# Altium project Carte_design.PrjPcb (part 1 of 2)
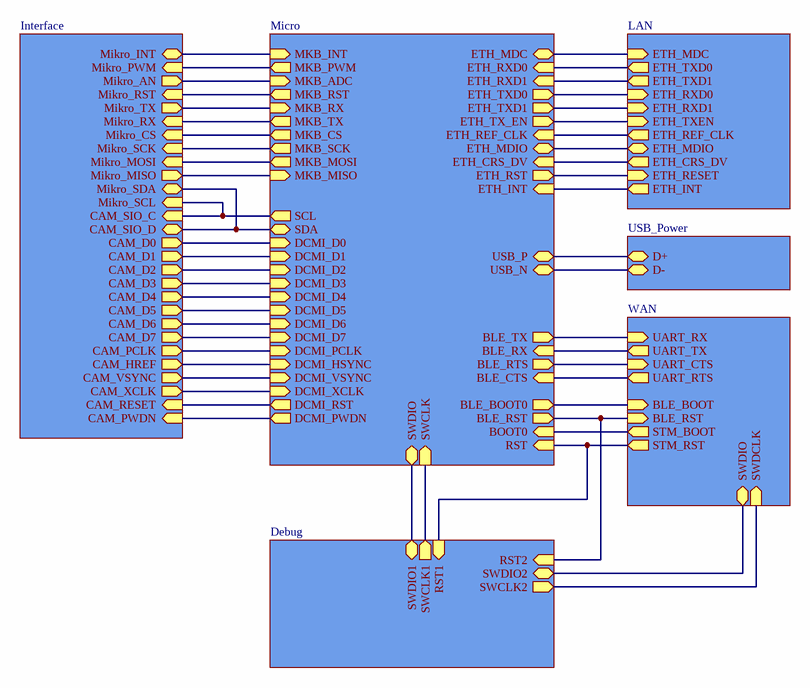
[diagram p0: Carte_design_SCH.SchDoc]
7 sheets, 181 parts. Net scope: hierarchical (ports join the sheet entries above them; power ports are global).
Board file: PCB_carte_design.PcbDoc
Sheets:
  Carte_design_SCH.SchDoc
    Interface = Interface.SchDoc
    USB_Power = USB_Power.SchDoc
    LAN = LAN.SchDoc
    WAN = WAN.SchDoc
    Micro = Micro.SchDoc
    Debug = Debug.SchDoc

## Sheet Carte_design_SCH.SchDoc: STM32_DEVBOARD
size A4; Revision: 1

### Sub-sheets
Debug = Debug.SchDoc: SWDIO2 (bidir), SWDIO1 (bidir), SWCLK1 (out), SWCLK2 (out), RST2 (in), RST1 (in)
Interface = Interface.SchDoc: Mikro_INT (bidir), Mikro_TX (out), Mikro_PWM (in), Mikro_AN (out), Mikro_SDA (bidir), Mikro_MISO (out), Mikro_RST (in), Mikro_SCL (in), Mikro_SCK (in), Mikro_MOSI (in), Mikro_CS (in), Mikro_RX (in), CAM_D6 (out), CAM_PCLK (out), CAM_D3 (out), CAM_RESET (in), CAM_D4 (out), CAM_SIO_C (in), CAM_D7 (out), CAM_D1 (out), CAM_D0 (out), CAM_SIO_D (bidir), CAM_HREF (out), CAM_D5 (out), CAM_VSYNC (out), CAM_D2 (out), CAM_PWDN (in), CAM_XCLK (out)
LAN = LAN.SchDoc: ETH_INT (out), ETH_MDC (in), ETH_REF_CLK (out), ETH_TXEN (in), ETH_MDIO (bidir), ETH_CRS_DV (out), ETH_RESET (in), ETH_TXD0 (out), ETH_TXD1 (out), ETH_RXD0 (in), ETH_RXD1 (in)
Micro = Micro.SchDoc: USB_N (bidir), DCMI_VSYNC (in), DCMI_D1 (in), DCMI_XCLK (in), SDA (bidir), BLE_RX (in), SWDIO (bidir), MKB_MOSI (out), MKB_RX (in), MKB_RST (out), ETH_MDC (bidir), ETH_RXD0 (in), DCMI_PWDN (out), ETH_MDIO (bidir), DCMI_D3 (in), DCMI_HSYNC (in), USB_P (bidir), DCMI_D2 (in), DCMI_D4 (in), BLE_RST (out), ETH_TXD0 (out), ETH_TXD1 (out), MKB_PWM (out), BLE_CTS (in), MKB_CS (out), ETH_TX_EN (out), DCMI_D6 (in), SWCLK (in), DCMI_D5 (in), DCMI_PCLK (in), SCL (out), MKB_SCK (out), ETH_RXD1 (in), DCMI_D0 (in), DCMI_D7 (in), DCMI_RST (out), MKB_MISO (in), BLE_BOOT0 (out), MKB_INT (in), BLE_TX (out), ETH_RST (out), MKB_TX (out), RST (in), MKB_ADC (in), BLE_RTS (out), BOOT0 (in), ETH_CRS_DV (in), ETH_REF_CLK (in), ETH_INT (in)
USB_Power = USB_Power.SchDoc: D+ (bidir), D- (bidir)
WAN = WAN.SchDoc: UART_RX (in), STM_RST (out), UART_TX (out), UART_CTS (in), BLE_BOOT (in), SWDIO (bidir), BLE_RST (in), UART_RTS (out), SWDCLK (in), STM_BOOT (out)

### Nets
CRS: sheet LAN/ETH_CRS_DV, sheet Micro/ETH_CRS_DV
INT: sheet LAN/ETH_INT, sheet Micro/ETH_INT
MDC: sheet LAN/ETH_MDC, sheet Micro/ETH_MDC
MDIO: sheet LAN/ETH_MDIO, sheet Micro/ETH_MDIO
REF_CLK: sheet LAN/ETH_REF_CLK, sheet Micro/ETH_REF_CLK
RST1: sheet WAN/STM_RST, sheet Micro/RST, sheet Debug/RST1
RST2: sheet WAN/BLE_RST, sheet Micro/BLE_RST, sheet Debug/RST2
RXD0: sheet LAN/ETH_RXD0, sheet Micro/ETH_TXD0
RXD1: sheet LAN/ETH_RXD1, sheet Micro/ETH_TXD1
SWCLK1: sheet Micro/SWCLK, sheet Debug/SWCLK1
SWCLK2: sheet WAN/SWDCLK, sheet Debug/SWCLK2
SWDIO1: sheet Micro/SWDIO, sheet Debug/SWDIO1
SWDIO2: sheet WAN/SWDIO, sheet Debug/SWDIO2
TXD0: sheet LAN/ETH_TXD0, sheet Micro/ETH_RXD0
TXD1: sheet LAN/ETH_TXD1, sheet Micro/ETH_RXD1
TXEN: sheet LAN/ETH_TXEN, sheet Micro/ETH_TX_EN
USB_COM_N: sheet USB_Power/D-, sheet Micro/USB_N
USB_COM_P: sheet USB_Power/D+, sheet Micro/USB_P
NetD3_2: sheet LAN/ETH_RESET, sheet Micro/ETH_RST
NetJ2_3: sheet Interface/Mikro_SCL, sheet Interface/CAM_SIO_C, sheet Micro/SCL
NetJ2_4: sheet Interface/Mikro_SDA, sheet Interface/CAM_SIO_D, sheet Micro/SDA
NetJ2_8: sheet Interface/CAM_XCLK, sheet Micro/DCMI_XCLK
NetJ2_17: sheet Interface/CAM_RESET, sheet Micro/DCMI_RST
NetJ2_18: sheet Interface/CAM_PWDN, sheet Micro/DCMI_PWDN
NetMIKROBUS_1_1: sheet Interface/Mikro_AN, sheet Micro/MKB_ADC
NetMIKROBUS_1_2: sheet Interface/Mikro_RST, sheet Micro/MKB_RST
NetMIKROBUS_1_3: sheet Interface/Mikro_CS, sheet Micro/MKB_CS
NetMIKROBUS_1_4: sheet Interface/Mikro_SCK, sheet Micro/MKB_SCK
NetMIKROBUS_1_5: sheet Interface/Mikro_MISO, sheet Micro/MKB_MISO
NetMIKROBUS_1_6: sheet Interface/Mikro_MOSI, sheet Micro/MKB_MOSI
NetMIKROBUS_1_13: sheet Interface/Mikro_TX, sheet Micro/MKB_RX
NetMIKROBUS_1_14: sheet Interface/Mikro_RX, sheet Micro/MKB_TX
NetMIKROBUS_1_15: sheet Interface/Mikro_INT, sheet Micro/MKB_INT
NetMIKROBUS_1_16: sheet Interface/Mikro_PWM, sheet Micro/MKB_PWM
NetR19_1: sheet Interface/CAM_VSYNC, sheet Micro/DCMI_VSYNC
NetR20_2: sheet Interface/CAM_HREF, sheet Micro/DCMI_HSYNC
NetR21_1: sheet Interface/CAM_PCLK, sheet Micro/DCMI_PCLK
NetR22_1: sheet Interface/CAM_D7, sheet Micro/DCMI_D7
NetR23_2: sheet Interface/CAM_D6, sheet Micro/DCMI_D6
NetR24_1: sheet Interface/CAM_D5, sheet Micro/DCMI_D5
NetR25_2: sheet Interface/CAM_D4, sheet Micro/DCMI_D4
NetR26_1: sheet Interface/CAM_D3, sheet Micro/DCMI_D3
NetR27_2: sheet Interface/CAM_D2, sheet Micro/DCMI_D2
NetR28_1: sheet Interface/CAM_D1, sheet Micro/DCMI_D1
NetR29_2: sheet Interface/CAM_D0, sheet Micro/DCMI_D0
NetR61_1: sheet WAN/UART_RX, sheet Micro/BLE_TX
NetR62_1: sheet WAN/UART_TX, sheet Micro/BLE_RX
NetR63_2: sheet WAN/BLE_BOOT, sheet Micro/BLE_BOOT0
NetR65_2: sheet WAN/STM_BOOT, sheet Micro/BOOT0
NetU10_11: sheet WAN/UART_RTS, sheet Micro/BLE_CTS
NetU10_12: sheet WAN/UART_CTS, sheet Micro/BLE_RTS

## Sheet Interface.SchDoc
size A4
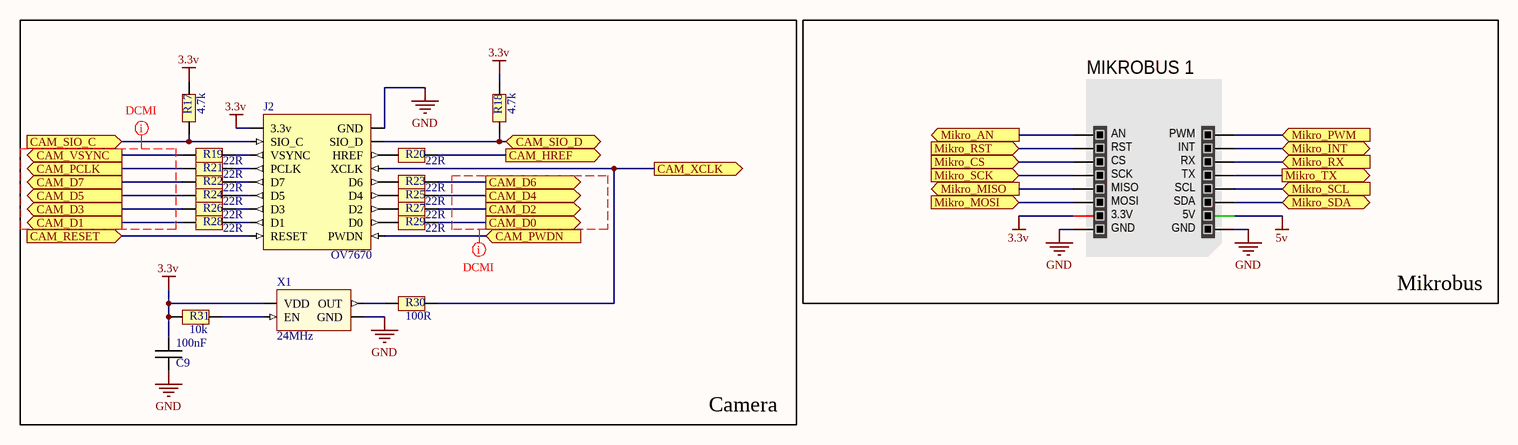
[diagram p1: Interface.SchDoc]

### Parts
C9  100nF  [0603]
J2  OV7670  [Header_2.54_2rang]
MIKROBUS_1  MIKROBUS HOST CONN.  [MIKROBUS HOST CONN.]  (value not drawn)
R17  4.7k  [0603]
R18  4.7k  [0603]
R19  22R  [0603]
R20  22R  [0603]
R21  22R  [0603]
R22  22R  [0603]
R23  22R  [0603]
R24  22R  [0603]
R25  22R  [0603]
R26  22R  [0603]
R27  22R  [0603]
R28  22R  [0603]
R29  22R  [0603]
R30  100R  [0603]
R31  10k  [0603]
X1  24MHz  [Oscillateur]

### Blocks framed on the sheet
Camera: C9 J2 R17-R31 X1
Mikrobus: MIKROBUS_1

### Ports
CAM_D0 (out), CAM_D1 (out), CAM_D2 (out), CAM_D3 (out), CAM_D4 (out), CAM_D5 (out), CAM_D6 (out), CAM_D7 (out), CAM_HREF (out), CAM_PCLK (out), CAM_PWDN (in), CAM_RESET (in), CAM_SIO_C (in), CAM_SIO_D (bidir), CAM_VSYNC (out), CAM_XCLK (out), Mikro_AN (out), Mikro_CS (in), Mikro_INT (bidir), Mikro_MISO (out), Mikro_MOSI (in), Mikro_PWM (in), Mikro_RST (in), Mikro_RX (in), Mikro_SCK (in), Mikro_SCL (in), Mikro_SDA (bidir), Mikro_TX (out)

### Nets
3.3v: C9.2 J2.1(3.3v) MIKROBUS_1.7(3.3V) R17.2 R18.2 R31.1 X1.4(VDD)
5v: MIKROBUS_1.10(5V)
GND: C9.1 J2.2(GND) MIKROBUS_1.8(GND) MIKROBUS_1.9(GND) X1.2(GND)
NetJ2_3: J2.3(SIO_C) MIKROBUS_1.12(SCL) R17.1 ; port Mikro_SCL, port CAM_SIO_C
NetJ2_4: J2.4(SIO_D) MIKROBUS_1.11(SDA) R18.1 ; port Mikro_SDA, port CAM_SIO_D
NetJ2_5: J2.5(VSYNC) R19.2
NetJ2_6: J2.6(HREF) R20.1
NetJ2_7: J2.7(PCLK) R21.2
NetJ2_8: J2.8(XCLK) R30.2 ; port CAM_XCLK
NetJ2_9: J2.9(D7) R22.2
NetJ2_10: J2.10(D6) R23.1
NetJ2_11: J2.11(D5) R24.2
NetJ2_12: J2.12(D4) R25.1
NetJ2_13: J2.13(D3) R26.2
NetJ2_14: J2.14(D2) R27.1
NetJ2_15: J2.15(D1) R28.2
NetJ2_16: J2.16(D0) R29.1
NetJ2_17: J2.17(RESET) ; port CAM_RESET
NetJ2_18: J2.18(PWDN) ; port CAM_PWDN
NetMIKROBUS_1_1: MIKROBUS_1.1(AN) ; port Mikro_AN
NetMIKROBUS_1_2: MIKROBUS_1.2(RST) ; port Mikro_RST
NetMIKROBUS_1_3: MIKROBUS_1.3(CS) ; port Mikro_CS
NetMIKROBUS_1_4: MIKROBUS_1.4(SCK) ; port Mikro_SCK
NetMIKROBUS_1_5: MIKROBUS_1.5(MISO) ; port Mikro_MISO
NetMIKROBUS_1_6: MIKROBUS_1.6(MOSI) ; port Mikro_MOSI
NetMIKROBUS_1_13: MIKROBUS_1.13(TX) ; port Mikro_TX
NetMIKROBUS_1_14: MIKROBUS_1.14(RX) ; port Mikro_RX
NetMIKROBUS_1_15: MIKROBUS_1.15(INT) ; port Mikro_INT
NetMIKROBUS_1_16: MIKROBUS_1.16(PWM) ; port Mikro_PWM
NetR19_1: R19.1 ; port CAM_VSYNC
NetR20_2: R20.2 ; port CAM_HREF
NetR21_1: R21.1 ; port CAM_PCLK
NetR22_1: R22.1 ; port CAM_D7
NetR23_2: R23.2 ; port CAM_D6
NetR24_1: R24.1 ; port CAM_D5
NetR25_2: R25.2 ; port CAM_D4
NetR26_1: R26.1 ; port CAM_D3
NetR27_2: R27.2 ; port CAM_D2
NetR28_1: R28.1 ; port CAM_D1
NetR29_2: R29.2 ; port CAM_D0
NetR30_1: R30.1 X1.3(OUT)
NetR31_2: R31.2 X1.1(EN)

### Layout directives
rule Matched Net Lengths [Tolerance = 2mm]; net class DCMI: (no net found under the mark)

### Library data of the parts
C9 = Capa
J2 = OV7670: Manufacturer 1: Samtec; Manufacturer Part Number 1: SSW-109-01-T-D; Max Current Rating: 6.9A; Contact Resistance: 10mR; Connector Type: Receptacle,Socket; Number of Positions: 18; Gender: Receptacle; Max Voltage Rating (AC): 550V; Mating Cycles: 100; Pitch: 2.54mm; Row Spacing: 0.1inch; Supplier 1: Mouser; Stock 1: 163; Pricing 1: 1=1,58000, 10=1,31000, 100=0,98000, 250=0,92500, 500=0,81600, 1000=0,72400 (USD); RoHS: Yes; Mount: Through Hole; Contact Plating: Tin,Matte; Contact Material: Bronze; Color: Black; Housing Color: Black; Housing Material: Polymer; Min Operating Temperature: -55°C; Max Operating Temperature: 105°C; Packaging: Bulk; Termination: Solder; Number of Rows: 2; Number of Contacts: 18; Orientation: Vertical; Length: 23.37mm; Depth: 4.95mm; Width: 4.95mm; Radiation Hardening: No; REACH SVHC: No SVHC; Lead Free: Lead Free; ComponentLink1URL: https://datasheet.ciiva.com/750/ssw-1xx-xx-xxx-x-xx-xxx-xx-mkt-750020.pdf?src-supplier=Digi-Key; ComponentLink1Description: https://datasheet.ciiva.com/750/ssw-1xx-xx-xxx-x-xx-xxx-xx-mkt-750020.pdf?src-supplier=Digi-Key; Supplier Part Number 1: 200-SSW10901TD
MIKROBUS_1 = MIKROBUS HOST CONN._1: mikroBUS Host Socket; Manufacturer 1: Multicomp; Manufacturer Part Number 1: 2212S-08SG-85; Gender: Receptacle; Number of Contacts: 8; Insulation Resistance: 1GR; SMD: No; Supplier 1: Farnell; Stock 1: 60017; Pricing 1: 15=0,18900, 150=0,13900, 500=0,12000, 1000=0,09780, 1500=0,09440, 5000=0,09090, 10000=0,08730, 20000=0,08380 (EUR); RoHS: Yes; Mount: Through Hole; Weight: 0.11lb; Contact Plating: Gold; Contact Material: Copper Alloy; Number of Rows: 1; Termination: Through Hole; Length: 0.83inch; Height: 0.35inch; Width: 0.12inch; REACH SVHC: No SVHC; Flammability Rating: UL94 V-0; ComponentLink1URL: https://datasheet.ciiva.com/1434/1662126-1434005.pdf?src-supplier=Element14; ComponentLink1Description: https://datasheet.ciiva.com/1434/1662126-1434005.pdf?src-supplier=Element14; Supplier Part Number 1: 1593463
R17-R31 = Resistance
X1 = Oscillateur: Manufacturer 1: Kyocera AVX; Manufacturer Part Number 1: KC2520B24.0000C10E00; Load Capacitance: 15pF; Max Supply Voltage: 3.63V; Min Supply Voltage: 1.6V; Frequency Tolerance: 50ppm; Current Rating: 3.5mA; Max Duty Cycle: 55%; Supplier 1: Mouser; Stock 1: 7192; Pricing 1: 1=1,34000, 10=1,28000, 50=1,26000, 100=1,07000, 500=1,04000, 1000=0,84100, 2000=0,79800, 10000=0,79600 (USD); RoHS: Yes; Mount: Surface Mount; Case/Package: CSMD; Number of Pins: 4; Min Operating Temperature: -10°C; Max Operating Temperature: 70°C; Packaging: Tape and Reel; Frequency: 24MHz; Package Quantity: 2000; Frequency Stability: 50ppm; Termination: SMD/SMT; Max Supply Current: 3.5mA; Length: 2.5mm; Height: 0.028inch; Width: 2mm; Depth: 2mm; Radiation Hardening: No; REACH SVHC: Unknown; Lead Free: Lead Free; ComponentLink1URL: https://datasheet.ciiva.com/7061/1794171-7061531.pdf?src-supplier=Newark; ComponentLink1Description: https://datasheet.ciiva.com/7061/1794171-7061531.pdf?src-supplier=Newark; Supplier Part Number 1: 581-KC2520B24.0C10

## Sheet USB_Power.SchDoc
size A4
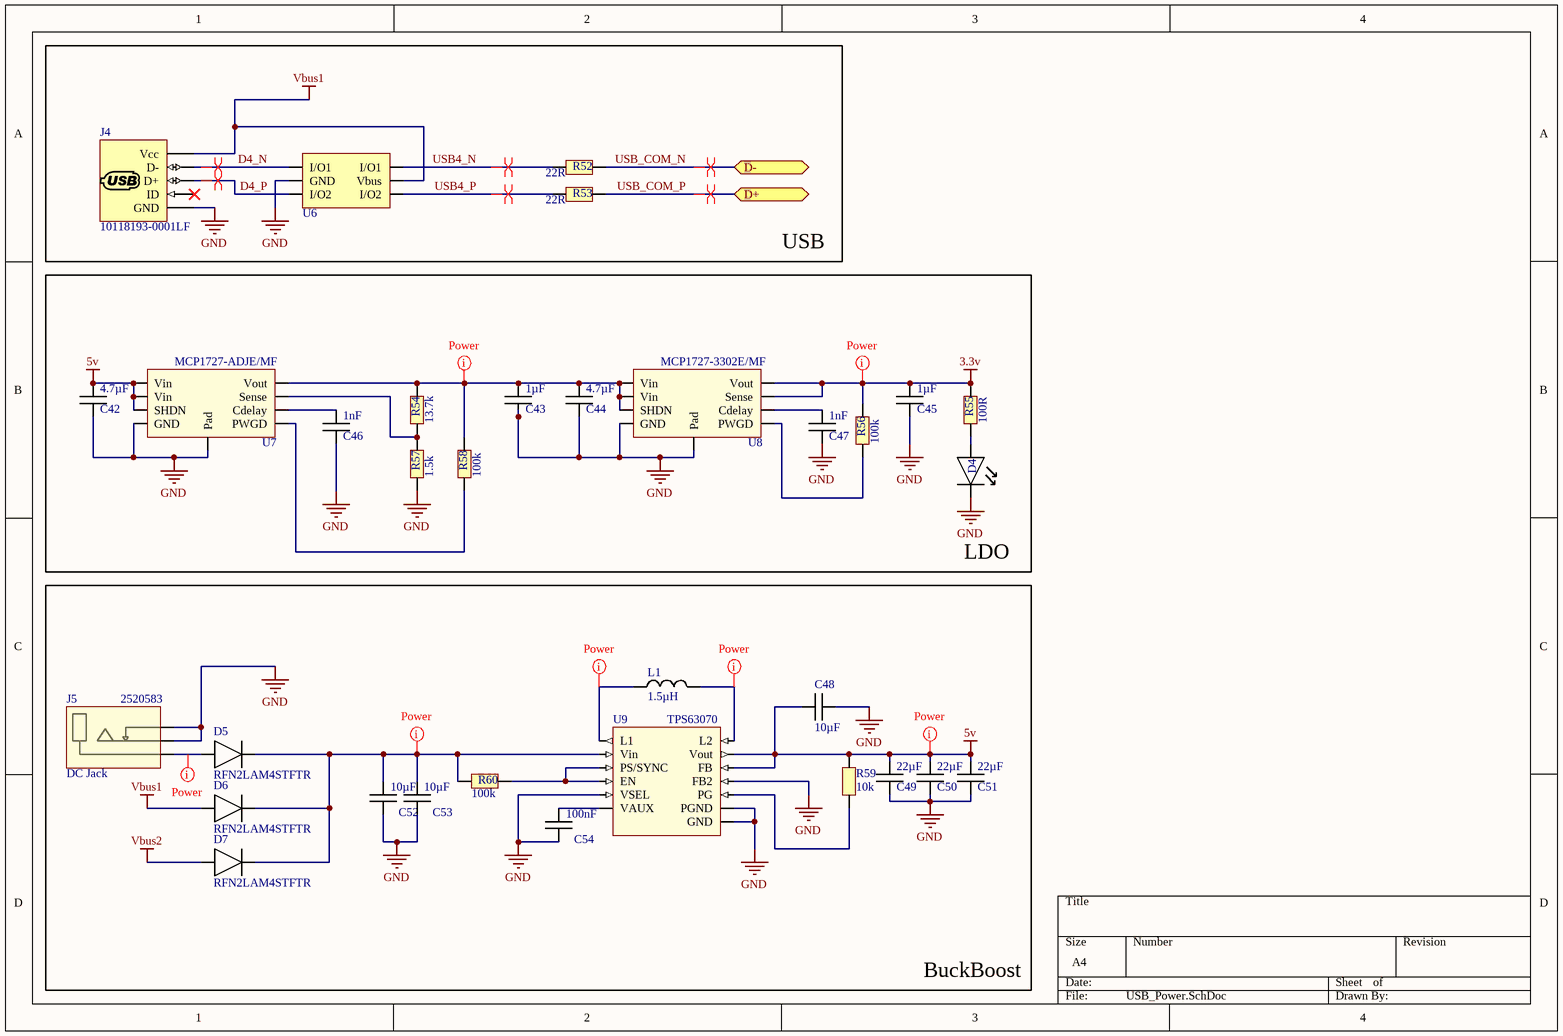
[diagram p2: USB_Power.SchDoc]

### Parts
C42  4.7µF  [0603]
C43  1µF  [0603]
C44  4.7µF  [0603]
C45  1µF  [0603]
C46  1nF  [0603]
C47  1nF  [0603]
C48  10µF  [0603]
C49  22µF  [0603]
C50  22µF  [0603]
C51  22µF  [0603]
C52  10µF  [0603]
C53  10µF  [0603]
C54  100nF  [0603]
D4  Led  [LED_0603]  (value not drawn)
D5  RFN2LAM4STFTR  [LEd_Pilou]
D6  RFN2LAM4STFTR  [LEd_Pilou]
D7  RFN2LAM4STFTR  [LEd_Pilou]
J4  10118193-0001LF  [Mini_USB_mixte]
J5  DC Jack  Supplier Part Number 1: 2520583  [Jack]
L1  1.5µH  [self_alim]
R52  22R  [0603]
R53  22R  [0603]
R54  13.7k  [0603]
R55  100R  [0603]
R56  100k  [0603]
R57  1.5k  [0603]
R58  100k  [0603]
R59  10k  [0603]
R60  100k  [0603]
U6  USBLC6-2P6  [SOT95P280X145-6M]  (value not drawn)
U7  MCP1727-ADJE/MF  [PSON65P300X100_HS-9M]
U8  MCP1727-3302E/MF  [PSON65P300X100_HS-9M]
U9  TPS63070  [BuckBoost]

### Blocks framed on the sheet
USB: J4 R52 R53 U6
LDO: C42-C47 D4 R54-R58 U7 U8
BuckBoost: C48-C54 D5-D7 J5 L1 R59 R60 U9

### Ports
D+ (bidir), D- (bidir)

### Nets
3.3v: C45.2 R55.2 R56.2 U8.7(Sense) U8.8(Vout)
5v: C42.2 C48.2 C49.2 C50.2 C51.2 R59.2 U7.1(Vin) U7.2(Vin) U7.3(SHDN) U9.5(FB) U9.7(Vout)
GND: C42.1 C43.1 C44.1 C45.1 C46.1 C47.1 C48.1 C49.1 C50.1 C51.1 C52.1 C53.1 C54.1 D4.2 J4.5(GND) J5.2(PAD) J5.3(PAD) R57.1 U6.2(GND) U7.4(GND) U7.9(Pad) U8.4(GND) U8.9(Pad) U9.4(GND) U9.6(FB2) U9.10(PGND) U9.15(VSEL)
Vbus1: D6.1 J4.1(Vcc) U6.5(Vbus)
Vbus2: D7.1
D4_N: J4.2(D-) U6.1(I/O1)
D4_P: J4.3(D+) U6.3(I/O2)
USB4_N: R52.1 U6.6(I/O1)
USB4_P: R53.1 U6.4(I/O2)
USB_COM_N: R52.2 ; port D-
USB_COM_P: R53.2 ; port D+
NetC43_2: C43.2 C44.2 R54.2 R58.2 U7.8(Vout) U8.1(Vin) U8.2(Vin) U8.3(SHDN)
NetC46_2: C46.2 U7.6(Cdelay)
NetC47_2: C47.2 U8.6(Cdelay)
NetC52_2: C52.2 C53.2 D5.2 D6.2 D7.2 R60.1 U9.12(Vin)
NetC54_2: C54.2 U9.3(VAUX)
NetD4_1: D4.1 R55.1
NetD5_1: D5.1 J5.1(PAD)
NetL1_1: L1.1 U9.11(L1)
NetL1_2: L1.2 U9.9(L2)
NetR54_1: R54.1 R57.2 U7.7(Sense)
NetR56_1: R56.1 U8.5(PWGD)
NetR58_1: R58.1 U7.5(PWGD)
NetR59_1: R59.1 U9.2(PG)
NetR60_2: R60.2 U9.1(PS/SYNC) U9.14(EN)

Not connected (* = marked no-connect by the designer): J4 4(ID)*

### Layout directives
differential pair; rule Differential Pairs Routing [Pref Gap = 0.25mm    Min Gap  = 0.25mm    Max Gap  = 0.25mmPref Width = 0.17mm    Min Width  = 0.17mm    Max Width  = 0.17mm]; net class USB_diff: D4_N, D4_P, USB4_N, USB4_P, USB_COM_N, USB_COM_P
net class Alim; rule Width Constraint [Pref Width = 1.367mm    Min Width = 0.254mm    Max Width = 1.367mm]: 3.3v, 5v, NetC43_2, NetC52_2, NetD5_1, NetL1_1, NetL1_2

### Library data of the parts
C42-C54 = Capa
D4 = Led: Manufacturer 1: Rohm; Manufacturer Part Number 1: SML-D12P8WT86C; Color: Green; Lens Color: White; Lens Style: Flat; Luminous Intensity: 6.3mcd; Forward Voltage: 2.2V; Test Current: 20mA; Dominant Wavelength: 560nm; Lens Size: 0.8mm; Supplier 1: Farnell; Supplier Part Number 1: 2687486; Stock 1: 22850; Pricing 1: 5=0,23500, 25=0,22800, 100=0,09470, 250=0,08760, 500=0,06920, 1000=0,05080 (EUR); RoHS: No; Mount: Surface Mount; Case/Package: 0603; Case Code (Imperial): 0603; Case Code (Metric): 1608; Packaging: Tape and Reel; Length: 1.6mm; Height: 0.65mm; Width: 0.8mm; ComponentLink1URL: http://www.farnell.com/datasheets/2186940.pdf?src-supplier=Farnell; ComponentLink1Description: http://www.farnell.com/datasheets/2186940.pdf?src-supplier=Farnell; ComponentLink2URL: https://www.rohm.com/datasheet/SML-D12P8W(C)/sml-d12x8(c)-e?src-supplier=Digi-Key; ComponentLink2Description: https://www.rohm.com/datasheet/SML-D12P8W(C)/sml-d12x8(c)-e?src-supplier=Digi-Key; ComponentLink3URL: http://www.farnell.com/datasheets/2186940.pdf?src-supplier=Newark; ComponentLink3Description: http://www.farnell.com/datasheets/2186940.pdf?src-supplier=Newark; ComponentLink4URL: http://www.farnell.com/datasheets/2186940.pdf?src-supplier=Element14; ComponentLink4Description: http://www.farnell.com/datasheets/2186940.pdf?src-supplier=Element14
D5-D7 = RFN2LAM4STFTR: RFN2LAM4STF IS THE HIGH RELIABIL; Manufacturer 1: Rohm; Max Reverse Voltage (DC): 400V; Average Rectified Current: 1.5A; Reverse Recovery Time: 30ns; Supplier 1: Mouser; Manufacturer Part Number 1: RFN2LAM4STFTR; Stock 1: 3480; Pricing 1: 1=0,46000, 10=0,37700, 100=0,23000, 1000=0,17800, 3000=0,15200, 9000=0,14100, 24000=0,13400, 45000=0,13100, 99000=0,12600 (USD); RoHS: No; Mount: Surface Mount; Packaging: Tape and Reel; ComponentLink1URL: https://www.rohm.com/datasheet/RFN2LAM4STF/rfn2lam4stf-e?src-supplier=Digi-Key; ComponentLink1Description: https://www.rohm.com/datasheet/RFN2LAM4STF/rfn2lam4stf-e?src-supplier=Digi-Key; Supplier Part Number 1: 755-RFN2LAM4STFTR
J4 = 10118193-0001LF: CONN RCPT USB2.0 MICRO B SMD R/A; Manufacturer 1: Amphenol FCI; Gender: Female; Connector Type: USB,Receptacle; Number of Contacts: 5; Insulation Resistance: 1GR; Number of Ports: 1; Current Rating: 1.8A; Max Voltage Rating (AC): 100V; Pitch: 0.65mm; Supplier 1: Digi-Key; Manufacturer Part Number 1: 10118193-0001LF; Stock 1: 117828; Pricing 1: 1=0,43000, 10=0,40500, 25=0,36440, 50=0,32400, 100=0,31040, 250=0,28344, 500=0,26994 (USD); RoHS: Yes; Mount: Surface Mount,Horizontal; Contact Material: Copper Alloy; Contact Plating: Gold; Color: Black; Number of Terminals: 5; Housing Material: Polymer; Min Operating Temperature: -55°C; Max Operating Temperature: 85°C; Termination: Solder; Orientation: Right Angle; Package Quantity: 1200; Packaging: Tape and Reel; Voltage Rating: 100V; Features: Shielded; Length: 7.86mm; Depth: 5.67mm; Radiation Hardening: No; Flammability Rating: UL94 V-0; ComponentLink1URL: https://datasheet.ciiva.com/851/10118193-851106.pdf?src-supplier=Digi-Key; ComponentLink1Description: https://datasheet.ciiva.com/851/10118193-851106.pdf?src-supplier=Digi-Key; ComponentLink2URL: https://datasheet.ciiva.com/14802/10118193-0001lf-webpage-14802386.pdf?src-supplier=Arrow; ComponentLink2Description: https://datasheet.ciiva.com/14802/10118193-0001lf-webpage-14802386.pdf?src-supplier=Arrow; ComponentLink3URL: https://datasheet.ciiva.com/26853/getdatasheetpartid-418618-26853893.pdf?src-supplier=Verical; ComponentLink3Description: https://datasheet.ciiva.com/26853/getdatasheetpartid-418618-26853893.pdf?src-supplier=Verical; ComponentLink4URL: https://datasheet.ciiva.com/4598/10118193ac-197151-4598799.pdf?src-supplier=Mouser; ComponentLink4Description: https://datasheet.ciiva.com/4598/10118193ac-197151-4598799.pdf?src-supplier=Mouser; ComponentLink5URL: https://datasheet.ciiva.com/851/10118193-851107.pdf?src-supplier=Digi-Key; ComponentLink5Description: https://datasheet.ciiva.com/851/10118193-851107.pdf?src-supplier=Digi-Key; ComponentLink6URL: https://datasheet.ciiva.com/851/10118193-851108.pdf?src-supplier=Digi-Key; ComponentLink6Description: https://datasheet.ciiva.com/851/10118193-851108.pdf?src-supplier=Digi-Key; ComponentLink7URL: https://datasheet.ciiva.com/14618/70236827-14618887.pdf?src-supplier=Allied+Electronics; ComponentLink7Description: https://datasheet.ciiva.com/14618/70236827-14618887.pdf?src-supplier=Allied+Electronics; Supplier Part Number 1: 609-4616-1-ND
J5 = Jack: Manufacturer 1: Cliff; Manufacturer Part Number 1: FC681465S; Current Rating: 2A; Voltage Rating: 12V; Gender: Male; Supplier 1: Farnell; Stock 1: 116; Pricing 1: 1=2,21000, 50=0,98100, 100=0,90100, 250=0,80300, 500=0,76100, 1000=0,73600 (EUR); RoHS: No; Termination: SMD/SMT; Voltage Rating (DC): 12V; REACH SVHC: No SVHC; ComponentLink1URL: http://www.farnell.com/datasheets/2005854.pdf?src-supplier=Farnell; ComponentLink1Description: http://www.farnell.com/datasheets/2005854.pdf?src-supplier=Farnell; ComponentLink2URL: http://www.farnell.com/datasheets/2005854.pdf?src-supplier=Element14; ComponentLink2Description: http://www.farnell.com/datasheets/2005854.pdf?src-supplier=Element14
L1 = self_alim: Manufacturer 1: Coilcraft; Manufacturer Part Number 1: XFL4020-152MEB; Core Material: Composite; Self Resonant Frequency: 59MHz; Shielding: Shielded; Tolerance: 20%; Inductance: 1.5uH; Max DC Current: 9.1A; DC Resistance (DCR): 15.8mR; Test Frequency: 100kHz; Supplier 1: Mouser; Stock 1: 10924; Pricing 1: 1=2,13000, 10=2,13000, 50=1,85000, 100=1,55000, 200=1,55000, 500=0,96000, 1000=0,88400, 2000=0,82300 (USD); RoHS: Yes; Min Operating Temperature: -40°C; Max Operating Temperature: 125°C; Packaging: Tape and Reel; Package Quantity: 25; Termination: SMD/SMT; Length: 4.3mm; Height: 2.1mm; Width: 4.3mm; Lead Free: Contains Lead; ComponentLink1URL: http://www.mouser.com/ds/2/597/xfl4020-270756.pdf?src-supplier=Mouser; ComponentLink1Description: http://www.mouser.com/ds/2/597/xfl4020-270756.pdf?src-supplier=Mouser; Supplier Part Number 1: 994-XFL4020-152MEB
R52-R60 = Resistance
U6 = USBLC6-2P6: TVS DIODE 5.25V 17V SOT666; Manufacturer 1: STMicroelectronics; Direction: Unidirectional,Bidirectional; Operating Supply Voltage: 5V; Number of Elements: 1; Capacitance: 3.5pF; Reverse Breakdown Voltage: 6V; Number of Channels: 2; Power Line Protection: Yes; Test Current: 1mA; Max Reverse Leakage Current: 150nA; Peak Pulse Current: 5A; Element Configuration: Dual; Supplier 1: Farnell; Manufacturer Part Number 1: USBLC6-2P6; Stock 1: 22255; Pricing 1: 5=0,45800, 50=0,40500, 100=0,24700, 500=0,19100, 1500=0,17700 (EUR); RoHS: Yes; Mount: Surface Mount; Case/Package: SOT-666; Number of Pins: 6; Contact Plating: Tin,Matte; Min Operating Temperature: -40°C; Max Operating Temperature: 125°C; Package Quantity: 1; Packaging: Tape and Reel; Number of Bidirectional Channels: 2; Reverse Standoff Voltage: 5V; Min Breakdown Voltage: 6V; Clamping Voltage: 17V; Polarity: Unidirectional,Bidirectional; Breakdown Voltage: 6V; Termination: SMD/SMT; Working Voltage: 5V; ESD Protection: Yes; Leakage Current: 150nA; Max Breakdown Voltage: 6V; Length: 1.7mm; Height: 0.6mm; Width: 1.3mm; Depth: 1.3mm; Radiation Hardening: No; REACH SVHC: No SVHC; Lead Free: Lead Free; ComponentLink1URL: https://datasheet.ciiva.com/15143/getdatasheetpartid-98673-15143462.pdf?src-supplier=Verical; ComponentLink1Description: https://datasheet.ciiva.com/15143/getdatasheetpartid-98673-15143462.pdf?src-supplier=Verical; ComponentLink2URL: https://datasheet.ciiva.com/14186/usblc6-2-st-eng-tds-14186568.pdf?src-supplier=Distrelec; ComponentLink2Description: https://datasheet.ciiva.com/14186/usblc6-2-st-eng-tds-14186568.pdf?src-supplier=Distrelec; ComponentLink3URL: https://datasheet.ciiva.com/22692/1690354-22692453.pdf?src-supplier=Element14; ComponentLink3Description: https://datasheet.ciiva.com/22692/1690354-22692453.pdf?src-supplier=Element14; ComponentLink4URL: https://datasheet.ciiva.com/22685/1690354-22685832.pdf?src-supplier=Element14; ComponentLink4Description: https://datasheet.ciiva.com/22685/1690354-22685832.pdf?src-supplier=Element14; ComponentLink5URL: https://datasheet.ciiva.com/16378/cd00050750-16378714.pdf?src-supplier=Future+Electronics; ComponentLink5Description: https://datasheet.ciiva.com/16378/cd00050750-16378714.pdf?src-supplier=Future+Electronics; ComponentLink6URL: https://datasheet.ciiva.com/4508/cd00050750-4508892.pdf?src-supplier=Mouser; ComponentLink6Description: https://datasheet.ciiva.com/4508/cd00050750-4508892.pdf?src-supplier=Mouser; ComponentLink7URL: https://datasheet.ciiva.com/41444/001184108-da-01-en-ic-esd-protection-usblc6-2p6-sot-666-stm-41444134.pdf?src-supplier=Conrad; ComponentLink7Description: https://datasheet.ciiva.com/41444/001184108-da-01-en-ic-esd-protection-usblc6-2p6-sot-666-stm-41444134.pdf?src-supplier=Conrad; Supplier Part Number 1: 1295310
U7 = LDO: Manufacturer 1: Microchip; Number of Outputs: 1; Min Input Voltage: 2.3V; Max Input Voltage: 6V; Output Voltage: 5V; Dropout Voltage: 330mV; Output Current: 1.5A; Input Bias Current: 120uA; Reference Voltage: 410mV; Min Output Voltage: 800mV; Polarity: Positive; Quiescent Current: 220uA; Accuracy: 0.5%; Output Type: Adjustable; Supplier 1: Farnell; Supplier Part Number 1: 1851979; Manufacturer Part Number 1: MCP1727-ADJE/MF; Stock 1: 1071; Pricing 1: 1=0,75600, 10=0,74900, 25=0,63900, 100=0,57400 (EUR); RoHS: Yes; Mount: Surface Mount; Case/Package: DFN; Number of Pins: 8; Min Operating Temperature: -40°C; Max Operating Temperature: 125°C; Packaging: Rail/Tube; Max Output Current: 1.5A; Package Quantity: 120; Max Output Voltage: 5V; Output Voltage Accuracy: 0.5%; Length: 3mm; Height: 0.95mm; Width: 3mm; Radiation Hardening: No; REACH SVHC: No SVHC; Lead Free: Lead Free; ComponentLink1URL: https://datasheet.ciiva.com/41458/001085927-da-01-en-ic-reg-ldo-adj-mcp1727-adje-mf-dfn-8-mcp-41458863.pdf?src-supplier=Conrad; ComponentLink1Description: https://datasheet.ciiva.com/41458/001085927-da-01-en-ic-reg-ldo-adj-mcp1727-adje-mf-dfn-8-mcp-41458863.pdf?src-supplier=Conrad; ComponentLink2URL: https://datasheet.ciiva.com/8239/jp027822-8239381.pdf?src-supplier=Avnet; ComponentLink2Description: https://datasheet.ciiva.com/8239/jp027822-8239381.pdf?src-supplier=Avnet; ComponentLink3URL: https://datasheet.ciiva.com/16592/jp027822-16592597.pdf?src-supplier=Avnet+Europe; ComponentLink3Description: https://datasheet.ciiva.com/16592/jp027822-16592597.pdf?src-supplier=Avnet+Europe; ComponentLink4URL: https://datasheet.ciiva.com/2041/21999b-2041127.pdf?src-supplier=Digi-Key; ComponentLink4Description: https://datasheet.ciiva.com/2041/21999b-2041127.pdf?src-supplier=Digi-Key; ComponentLink5URL: https://datasheet.ciiva.com/8041/490994-8041415.pdf?src-supplier=Element14; ComponentLink5Description: https://datasheet.ciiva.com/8041/490994-8041415.pdf?src-supplier=Element14
U8 = LDO: Manufacturer 1: Microchip; Output Current: 1.5A; Output Voltage: 3.3V; Dropout Voltage: 330mV; Max Input Voltage: 6V; Min Input Voltage: 2.3V; Number of Outputs: 1; Input Bias Current: 120uA; Polarity: Positive; Quiescent Current: 220uA; Accuracy: 2%; Output Type: Fixed; Supplier 1: Farnell; Supplier Part Number 1: 1851978; Manufacturer Part Number 1: MCP1727-3302E/MF; Stock 1: 1015; Pricing 1: 1=0,75600, 10=0,74900, 25=0,63900, 100=0,57400 (EUR); RoHS: Yes; Mount: Surface Mount; Case/Package: DFN; Number of Pins: 8; Min Operating Temperature: -40°C; Max Operating Temperature: 125°C; Package Quantity: 120; Packaging: Rail/Tube; Max Output Current: 1.5A; Min Output Voltage: 3.3V; Output Voltage Accuracy: 2%; Length: 3mm; Height: 0.95mm; Width: 3mm; Radiation Hardening: No; REACH SVHC: No SVHC; Lead Free: Lead Free; ComponentLink1URL: https://datasheet.ciiva.com/41458/001085925-da-01-en-ic-reg-ldo-3-mcp1727-3302e-mf-dfn-8-mcp-41458860.pdf?src-supplier=Conrad; ComponentLink1Description: https://datasheet.ciiva.com/41458/001085925-da-01-en-ic-reg-ldo-3-mcp1727-3302e-mf-dfn-8-mcp-41458860.pdf?src-supplier=Conrad; ComponentLink2URL: https://datasheet.ciiva.com/2057/21999b-2057399.pdf?src-supplier=Digi-Key; ComponentLink2Description: https://datasheet.ciiva.com/2057/21999b-2057399.pdf?src-supplier=Digi-Key; ComponentLink3URL: https://datasheet.ciiva.com/15200/getdatasheetpartid-453602-15200278.pdf?src-supplier=Verical; ComponentLink3Description: https://datasheet.ciiva.com/15200/getdatasheetpartid-453602-15200278.pdf?src-supplier=Verical
U9 = 12-5V_BuckBoost: Manufacturer 1: Texas Instruments; Manufacturer Part Number 1: TPS630701RNMR; Quiescent Current: 50uA; Supplier 1: Mouser; Stock 1: 3900; Pricing 1: 1=2,59000, 10=2,20000, 100=1,76000, 500=1,54000, 1000=1,28000, 3000=1,19000, 6000=1,15000, 9000=1,10000 (USD); RoHS: No; Lead Free: Lead Free; ComponentLink1URL: http://www.ti.com/lit/ds/symlink/tps63070.pdf?src-supplier=Digi-Key; ComponentLink1Description: http://www.ti.com/lit/ds/symlink/tps63070.pdf?src-supplier=Digi-Key; Supplier Part Number 1: 595-TPS630701RNMR

## Sheet LAN.SchDoc
size A4
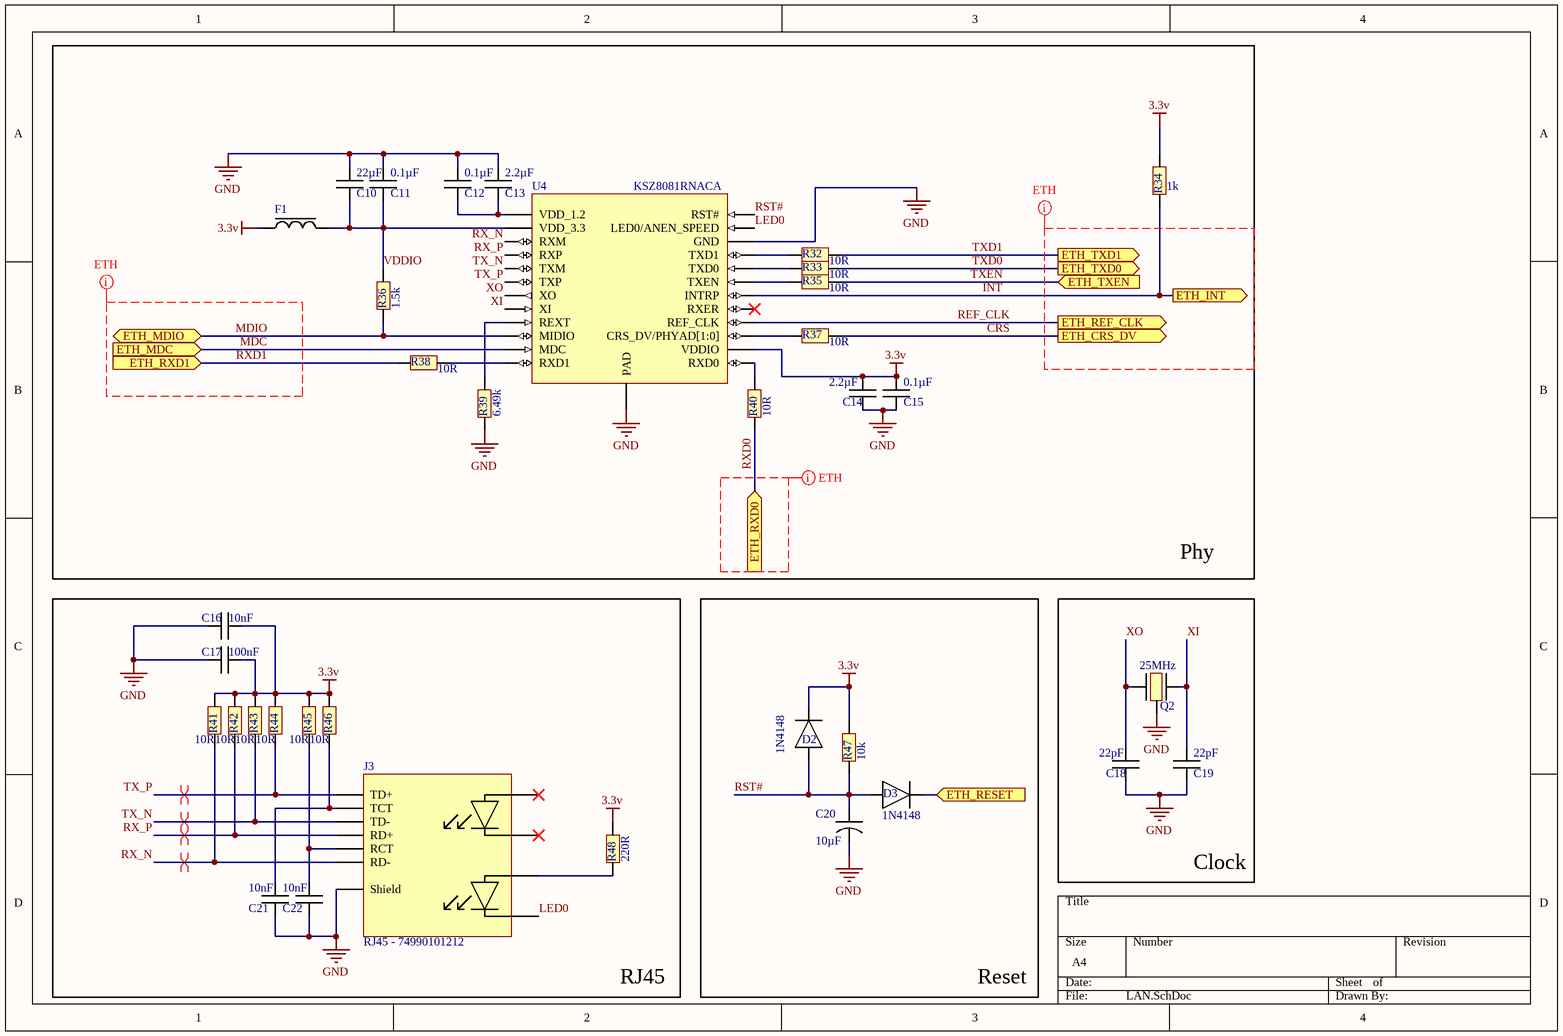
[diagram p3: LAN.SchDoc]

### Parts
C10  22µF  [0603]
C11  0.1µF  [0603]
C12  0.1µF  [0603]
C13  2.2µF  [0603]
C14  2.2µF  [0603]
C15  0.1µF  [0603]
C16  10nF  [0603]
C17  100nF  [0603]
C18  22pF  [0603]
C19  22pF  [0603]
C20  10µF  [Capa_Radial_D4mm_H5.5mm]
C21  10nF  [0603]
C22  10nF  [0603]
D2  1N4148  [SOD123]
D3  1N4148  [SOD123]
F1  Ferrite  [0805_W1.25]  (value not drawn)
J3  RJ45 - 74990101212  [RJ45]
Q2  25MHz  [SMD_3225]
R32  10R  [0603]
R33  10R  [0603]
R34  1k  [0603]
R35  10R  [0603]
R36  1.5k  [0603]
R37  10R  [0603]
R38  10R  [0603]
R39  6.49k  [0603]
R40  10R  [0603]
R41  10R  [0603]
R42  10R  [0603]
R43  10R  [0603]
R44  10R  [0603]
R45  10R  [0603]
R46  10R  [0603]
R47  10k  [0603]
R48  220R  [0603]
U4  KSZ8081RNACA  [QFN50P400X400X90_HS-25M]

### Blocks framed on the sheet
Phy: C10-C15 F1 R32-R40 U4
RJ45: C16 C17 C21 C22 J3 R41-R46 R48
Reset: C20 D2 D3 R47
Clock: C18 C19 Q2

### Ports
ETH_CRS_DV (out), ETH_INT (out), ETH_MDC (in), ETH_MDIO (bidir), ETH_REF_CLK (out), ETH_RESET (in), ETH_RXD0 (in), ETH_RXD1 (in), ETH_TXD0 (out), ETH_TXD1 (out), ETH_TXEN (in)

### Nets
3.3v: C14.2 C15.2 C16.2 C17.2 D2.2 F1.1 R34.1 R41.2 R42.2 R43.2 R44.2 R45.2 R46.2 R47.2 R48.2 U4.14(VDDIO)
GND: C10.2 C11.2 C12.2 C13.2 C14.1 C15.1 C16.1 C17.1 C18.1 C19.1 C20.2 C21.1 C22.1 J3.8(Shield) Q2.3 R39.1 U4.22(GND) U4.25(PAD)
CRS: R37.1 ; port ETH_CRS_DV
INT: R34.2 U4.18(INTRP) ; port ETH_INT
LED0: J3.11 U4.23(LED0/ANEN_SPEED)
MDC: U4.11(MDC) ; port ETH_MDC
MDIO: R36.1 U4.10(MIDIO) ; port ETH_MDIO
REF_CLK: U4.16(REF_CLK) ; port ETH_REF_CLK
RST#: C20.1 D2.1 D3.1 R47.1 U4.24(RST#)
RX_N: J3.6(RD-) R41.1 U4.3(RXM)
RX_P: J3.4(RD+) R42.1 U4.4(RXP)
RXD0: R40.2 ; port ETH_RXD0
RXD1: R38.1 ; port ETH_RXD1
TX_N: J3.3(TD-) R43.1 U4.5(TXM)
TX_P: J3.1(TD+) R44.1 U4.6(TXP)
TXD0: R33.1 ; port ETH_TXD0
TXD1: R32.1 ; port ETH_TXD1
TXEN: R35.1 ; port ETH_TXEN
VDDIO: C10.1 C11.1 F1.2 R36.2 U4.2(VDD_3.3)
XI: C19.2 Q2.2 U4.8(XI)
XO: C18.2 Q2.1 U4.7(XO)
NetC12_1: C12.1 C13.1 U4.1(VDD_1.2)
NetC21_2: C21.2 J3.2(TCT) R46.1
NetC22_2: C22.2 J3.5(RCT) R45.1
NetD3_2: D3.2 ; port ETH_RESET
NetJ3_12: J3.12 R48.1
NetR32_2: R32.2 U4.21(TXD1)
NetR33_2: R33.2 U4.20(TXD0)
NetR35_2: R35.2 U4.19(TXEN)
NetR37_2: R37.2 U4.15(CRS_DV/PHYAD[1:0])
NetR38_2: R38.2 U4.12(RXD1)
NetR39_2: R39.2 U4.9(REXT)
NetR40_1: R40.1 U4.13(RXD0)

Not connected (* = marked no-connect by the designer): J3 9* 10(11)*; U4 17(RXER)*

### Layout directives
rule Matched Net Lengths [Tolerance = 2mm]; net class ETH: (no net found under the mark), MDC, MDIO, RXD1
differential pair; rule Differential Pairs Routing [Pref Gap = 0.3mm    Min Gap  = 0.2mm    Max Gap  = 0.4mmPref Width = 0.2mm    Min Width  = 0.1mm    Max Width  = 0.3mm]; net class ETH_DIFF: RX_N, RX_P, TX_N, TX_P

### Library data of the parts
C10-C19 C21 C22 = Capa
C20 = Capa_pola: Manufacturer 1: Wurth Electronics; Manufacturer Part Number 1: 865090240001; Voltage Rating: 10V; Polarity: Polar; Ripple Current: 23mA; Life (Hours): 1000Hour; Tolerance: 20%; Capacitance: 10uF; Supplier 1: Farnell; Supplier Part Number 1: 2466357; Stock 1: 126; Pricing 1: 1=0,23700, 5=0,23100, 10=0,20400, 20=0,16500, 40=0,16300, 100=0,11300, 500=0,08920 (EUR); RoHS: Yes; Mount: Surface Mount; Case/Package: Radial; Min Operating Temperature: -40°C; Max Operating Temperature: 85°C; Package Quantity: 2000; Packaging: Cut Tape; Ripple Current (AC): 23mA; Voltage Rating (DC): 10V; Diameter: 4mm; Height: 5.5mm; Height - Seated (Max): 0.217inch; REACH SVHC: Unknown; ComponentLink1URL: http://www.farnell.com/datasheets/1880200.pdf?src-supplier=Farnell; ComponentLink1Description: http://www.farnell.com/datasheets/1880200.pdf?src-supplier=Farnell; ComponentLink2URL: http://www.farnell.com/datasheets/1880200.pdf?src-supplier=Element14; ComponentLink2Description: http://www.farnell.com/datasheets/1880200.pdf?src-supplier=Element14; ComponentLink3URL: https://katalog.we-online.de/pbs/datasheet/865090240001.pdf?src-supplier=Digi-Key; ComponentLink3Description: https://katalog.we-online.de/pbs/datasheet/865090240001.pdf?src-supplier=Digi-Key; ComponentLink4URL: http://katalog.we-online.de/pbs/datasheet/865090240001.pdf?src-supplier=Digi-Key; ComponentLink4Description: http://katalog.we-online.de/pbs/datasheet/865090240001.pdf?src-supplier=Digi-Key
D2 D3 = 1N4148: Manufacturer 1: Diodes; Manufacturer Part Number 1: 1N4148W-7-F; Current Rating: 150mA; Voltage: 100V; Current: 15A; Max Surge Current: 2A; Peak Reverse Current: 1uA; Recovery Time: 4ns; Forward Voltage: 1.25V; Average Rectified Current: 300mA; Power Dissipation: 400mW; Element Configuration: Single; Polarity: Standard; Voltage Rating (DC): 75V; Capacitance: 2pF; Supplier 1: Farnell; Stock 1: 844343; Pricing 1: 5=0,16300, 25=0,15900, 100=0,05530, 250=0,05220, 500=0,04810, 1000=0,02600, 5000=0,01940 (EUR); RoHS: Yes; Mount: Surface Mount; Number of Pins: 2; Weight: 0.000353oz; Contact Plating: Tin,Matte; Min Operating Temperature: -65°C; Max Operating Temperature: 150°C; Package Quantity: 3000; Packaging: Tape and Reel; Forward Current: 150mA; Reverse Recovery Time: 4ns; Max Repetitive Reverse Voltage (Vrrm): 100V; Max Forward Surge Current (Ifsm): 2A; Peak Non-Repetitive Surge Current: 2A; Power Rating: 400mW; Output Current: 150mA; Max Reverse Voltage (DC): 100V; Length: 2.85mm; Height: 1.25mm; Width: 1.7mm; Radiation Hardening: No; Lead Free: Lead Free; REACH SVHC: No SVHC; ComponentLink1URL: https://datasheet.ciiva.com/22695/1915529-22695239.pdf?src-supplier=Element14; ComponentLink1Description: https://datasheet.ciiva.com/22695/1915529-22695239.pdf?src-supplier=Element14; ComponentLink2URL: https://datasheet.ciiva.com/911/ds30086-911736.pdf?src-supplier=Digi-Key; ComponentLink2Description: https://datasheet.ciiva.com/911/ds30086-911736.pdf?src-supplier=Digi-Key; ComponentLink3URL: https://datasheet.ciiva.com/1179/1915529-1179304.pdf?src-supplier=Element14; ComponentLink3Description: https://datasheet.ciiva.com/1179/1915529-1179304.pdf?src-supplier=Element14; ComponentLink4URL: https://datasheet.ciiva.com/25919/ds30086-25919609.pdf?src-supplier=Avnet+Europe; ComponentLink4Description: https://datasheet.ciiva.com/25919/ds30086-25919609.pdf?src-supplier=Avnet+Europe; ComponentLink5URL: https://datasheet.ciiva.com/15219/getdatasheetpartid-110030-15219548.pdf?src-supplier=Verical; ComponentLink5Description: https://datasheet.ciiva.com/15219/getdatasheetpartid-110030-15219548.pdf?src-supplier=Verical; ComponentLink6URL: https://datasheet.ciiva.com/911/ds30086-911734.pdf?src-supplier=Digi-Key; ComponentLink6Description: https://datasheet.ciiva.com/911/ds30086-911734.pdf?src-supplier=Digi-Key; ComponentLink7URL: https://datasheet.ciiva.com/911/ds30086-911735.pdf?src-supplier=Digi-Key; ComponentLink7Description: https://datasheet.ciiva.com/911/ds30086-911735.pdf?src-supplier=Digi-Key; ComponentLink8URL: https://datasheet.ciiva.com/4435/ds30086-4435128.pdf?src-supplier=Mouser; ComponentLink8Description: https://datasheet.ciiva.com/4435/ds30086-4435128.pdf?src-supplier=Mouser; ComponentLink9URL: https://datasheet.ciiva.com/8300/ds30086-8300392.pdf?src-supplier=Avnet; ComponentLink9Description: https://datasheet.ciiva.com/8300/ds30086-8300392.pdf?src-supplier=Avnet; ComponentLink10URL: https://datasheet.ciiva.com/8303/ds30086-8303197.pdf?src-supplier=Avnet; ComponentLink10Description: https://datasheet.ciiva.com/8303/ds30086-8303197.pdf?src-supplier=Avnet; Supplier Part Number 1: 1776392
F1 = Ferrite: Manufacturer 1: Murata; Manufacturer Part Number 1: BLM21PG121SN1D; Material: Steel,Ferrite; Impedance: 120R; Current Rating: 3A; DC Resistance (DCR): 30mR; Number of Lines: 1; Tolerance: 25%; Test Frequency: 100MHz; Supplier 1: Farnell; Stock 1: 13249; Pricing 1: 10=0,06150, 100=0,03810, 500=0,02760, 1000=0,02500, 2000=0,02050, 4000=0,01820, 20000=0,01430 (EUR); RoHS: Yes; Case/Package: 0805; Number of Pins: 2; Case Code (Metric): 2012; Case Code (Imperial): 0805; Min Operating Temperature: -55°C; Max Operating Temperature: 125°C; Packaging: Tape and Reel; Number of Circuits: 1; Package Quantity: 1; Max Current Rating: 3A; Max DC Current: 3A; Termination: SMD/SMT; Length: 2mm; Height: 0.85mm; Width: 1.25mm; Depth: 1.25mm; REACH SVHC: No SVHC; Lead Free: Lead Free; ComponentLink1URL: https://datasheet.ciiva.com/16420/l0110s0100blm21p-16420725.pdf?src-supplier=Future+Electronics; ComponentLink1Description: https://datasheet.ciiva.com/16420/l0110s0100blm21p-16420725.pdf?src-supplier=Future+Electronics; ComponentLink2URL: https://datasheet.ciiva.com/6211/l0110s0100blm21p-6211734.pdf?src-supplier=Digi-Key; ComponentLink2Description: https://datasheet.ciiva.com/6211/l0110s0100blm21p-6211734.pdf?src-supplier=Digi-Key; ComponentLink3URL: https://datasheet.ciiva.com/6211/l0110s0100blm21p-6211738.pdf?src-supplier=Digi-Key; ComponentLink3Description: https://datasheet.ciiva.com/6211/l0110s0100blm21p-6211738.pdf?src-supplier=Digi-Key; ComponentLink4URL: https://datasheet.ciiva.com/6211/l0110s0100blm21p-6211739.pdf?src-supplier=Digi-Key; ComponentLink4Description: https://datasheet.ciiva.com/6211/l0110s0100blm21p-6211739.pdf?src-supplier=Digi-Key; ComponentLink5URL: https://datasheet.ciiva.com/46423/1756152-46423915.pdf?src-supplier=Element14; ComponentLink5Description: https://datasheet.ciiva.com/46423/1756152-46423915.pdf?src-supplier=Element14; Supplier Part Number 1: 2443252
J3 = RJ45: Manufacturer 1: Wurth Electronics; Supplier 1: Mouser; Manufacturer Part Number 1: 74990101212; Stock 1: 68; Pricing 1: 1=6,59000, 10=6,21000, 25=5,99000, 50=5,88000, 100=5,76000, 250=5,48000, 500=5,19000, 1000=4,91000, 2500=4,51000 (USD); RoHS: No; ComponentLink1URL: http://www.farnell.com/datasheets/2277299.pdf?src-supplier=Farnell; ComponentLink1Description: http://www.farnell.com/datasheets/2277299.pdf?src-supplier=Farnell; ComponentLink2URL: https://katalog.we-online.de/pbs/datasheet/74990101212.pdf?src-supplier=Digi-Key; ComponentLink2Description: https://katalog.we-online.de/pbs/datasheet/74990101212.pdf?src-supplier=Digi-Key; ComponentLink3URL: http://www.farnell.com/datasheets/2277299.pdf?src-supplier=Newark; ComponentLink3Description: http://www.farnell.com/datasheets/2277299.pdf?src-supplier=Newark; Supplier Part Number 1: 710-74990101212
Q2 = Quartz_25MHz: Manufacturer 1: Multicomp; Manufacturer Part Number 1: MCSJK-7U-25.00-12-10-60-B-10; Supplier 1: Farnell; Stock 1: 529; Pricing 1: 5=0,16400, 50=0,13300, 250=0,12300, 500=0,11500, 1500=0,11100, 3000=0,10000, 15000=0,09850 (EUR); RoHS: No; ComponentLink1URL: http://www.farnell.com/datasheets/2645227.pdf?src-supplier=Farnell; ComponentLink1Description: http://www.farnell.com/datasheets/2645227.pdf?src-supplier=Farnell; Supplier Part Number 1: 2853968
R32-R48 = Resistance
U4 = KSZ8081RNACA: IC TXRX ETHERNET 24QFN; Manufacturer 1: Microchip; Simplex/Duplex: Full Duplex; Supplier 1: Farnell; Manufacturer Part Number 1: KSZ8081RNACA; Stock 1: 869; Pricing 1: 1=0,89100, 25=0,82400, 100=0,75700 (EUR); RoHS: Yes; Mount: Surface Mount; Case/Package: QFN; Min Operating Temperature: 0°C; Max Operating Temperature: 70°C; Packaging: Rail/Tube; ComponentLink1URL: http://www.farnell.com/datasheets/2310338.pdf?src-supplier=Farnell; ComponentLink1Description: http://www.farnell.com/datasheets/2310338.pdf?src-supplier=Farnell; ComponentLink2URL: http://www.microchip.com/mymicrochip/filehandler.aspx?ddocname=en581592&src-supplier=Digi-Key; ComponentLink2Description: http://www.microchip.com/mymicrochip/filehandler.aspx?ddocname=en581592&src-supplier=Digi-Key; Supplier Part Number 1: 2809920